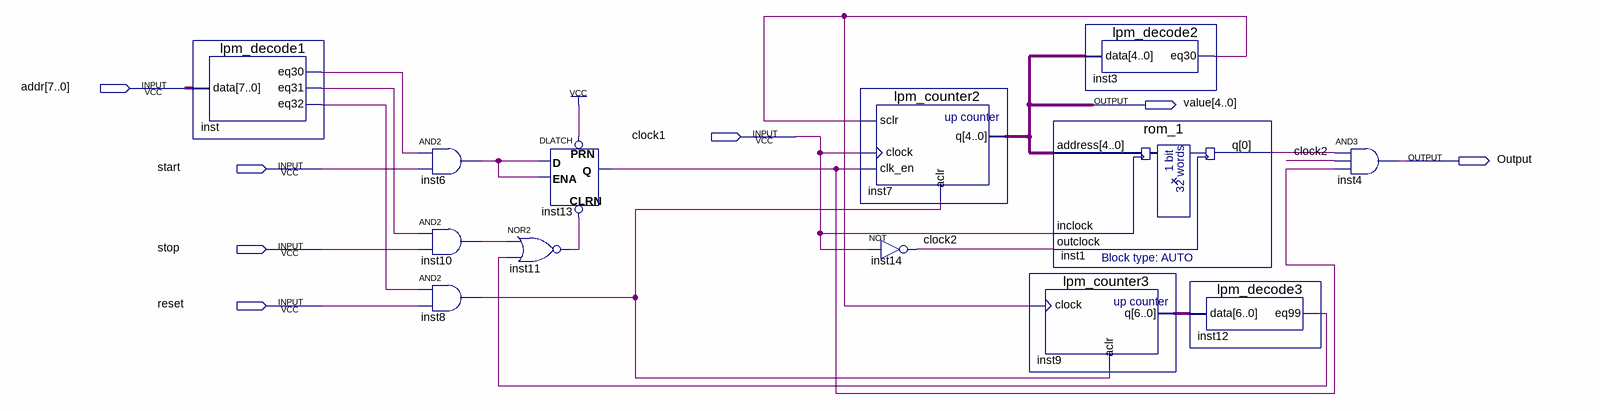
[diagram p0: schematic sheet]
// Quartus schematic PPZU.bdf as structural Verilog: 13 symbols, 7 pins
module PPZU (
  input  [7:0] addr,
  input  clock1,
  input  start,
  input  stop,
  input  reset,
  output [4:0] value,
  output Output
);

  wire clock2, inst1_q, inst3_eq30, inst6_out, inst8_out, inst10_out, inst11_out, inst12_eq99, inst13_q,
       inst_eq30, inst_eq31, inst_eq32;
  wire [6:0] inst9_q;

  lpm_decode1 inst (.data(addr), .eq30(inst_eq30), .eq31(inst_eq31), .eq32(inst_eq32));
  and inst6 (inst6_out, inst_eq30, start);
  and inst10 (inst10_out, inst_eq31, stop);
  and inst8 (inst8_out, inst_eq32, reset);
  nor inst11 (inst11_out, inst10_out, inst12_eq99);
  DLATCH inst13 (.CLRN(inst11_out), .D(inst6_out), .ENA(inst6_out), .PRN(1'b1), .Q(inst13_q));
  lpm_counter2 inst7 (.sclr(inst3_eq30), .clock(clock1), .clk_en(inst13_q), .aclr(inst8_out), .q(value));
  not inst14 (clock2, clock1);
  lpm_decode2 inst3 (.data(value), .eq30(inst3_eq30));
  rom_1 inst1 (.address(value), .inclock(clock1), .outclock(clock2), .q(inst1_q));
  lpm_counter3 inst9 (.clock(inst3_eq30), .aclr(inst8_out), .q(inst9_q));
  lpm_decode3 inst12 (.data(inst9_q), .eq99(inst12_eq99));
  and inst4 (Output, inst1_q, clock2, inst13_q);
endmodule
